# Altium project TTDT2.PrjPcb
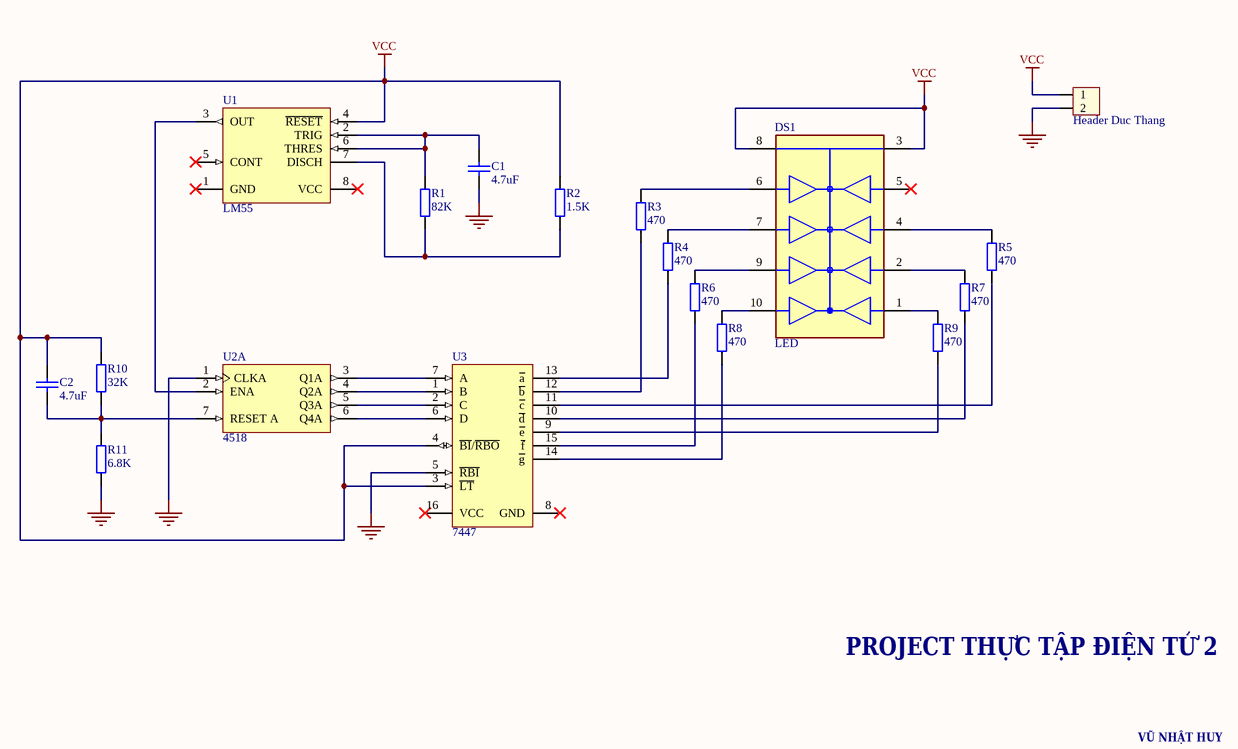
[diagram p0: Sheet1.SchDoc]
1 sheet, 18 parts. Net scope: global (net labels, ports and power ports of the same name join across sheets).
Board file: PCB1.PcbDoc

## Sheet Sheet1.SchDoc
size A4; SheetNumber: 1; SheetTotal: 1

### Parts
C1  4.7uF  [tu gom]
C2  4.7uF  [tu gom]
DS1  LED  [FP-HDSP-H153-MFG]
H1  Header Duc Thang  [VH3.96M-2]
R1  82K  [RES_0805]
R2  1.5K  [RES_0805]
R3  470  [RES_0805]
R4  470  [RES_0805]
R5  470  [RES_0805]
R6  470  [RES_0805]
R7  470  [RES_0805]
R8  470  [RES_0805]
R9  470  [RES_0805]
R10  32K  [RES_0805]
R11  6.8K  [RES_0805]
U1  LM55  [P0008A]
U2  4518  [N0016A]  (part A of 3)
U3  7447  [N0016A]

### Nets
GND: C1.2 H1.2 R11.1 U2.1(CLKA) U3.5(~{RBI})
VCC: C2.1 DS1.3(C) DS1.8(C) H1.1 R2.2 R10.2 U1.4(~{RESET}) U3.3(~{LT}) U3.4(~{BI}/~{RBO})
NetC1_1: C1.1 R1.2 U1.2(TRIG) U1.6(THRES)
NetC2_2: C2.2 R10.1 R11.2 U2.7(RESET_A)
NetDS1_1: DS1.1(ANODE_e) R9.1
NetDS1_2: DS1.2(ANODE_d) R7.1
NetDS1_4: DS1.4(ANODE_c) R5.1
NetDS1_6: DS1.6(ANODE_b) R3.2
NetDS1_7: DS1.7(ANODE_a) R4.2
NetDS1_9: DS1.9(ANODE_f) R6.2
NetDS1_10: DS1.10(ANODE_g) R8.2
NetR1_1: R1.1 R2.1 U1.7(DISCH)
NetR3_1: R3.1 U3.12(~{b})
NetR4_1: R4.1 U3.13(~{a})
NetR5_2: R5.2 U3.11(~{c})
NetR6_1: R6.1 U3.15(~{f})
NetR7_2: R7.2 U3.10(~{d})
NetR8_1: R8.1 U3.14(~{g})
NetR9_2: R9.2 U3.9(~{e})
NetU1_3: U1.3(OUT) U2.2(ENA)
NetU2_3: U2.3(Q1A) U3.7(A)
NetU2_4: U2.4(Q2A) U3.1(B)
NetU2_5: U2.5(Q3A) U3.2(C)
NetU2_6: U2.6(Q4A) U3.6(D)

Not connected (* = marked no-connect by the designer): DS1 5(ANODE_DP)*; U1 1(GND)* 5(CONT)* 8(VCC)*; U3 8(GND)* 16(VCC)*

### Notes on the sheet
- PROJECT THỰC TẬP ĐIỆN TỬ 2
- VŨ NHẬT HUY

### Library data of the parts
C1 C2 = Tu gom 472 50V: Cắm; Don_Vi: Con; So_Chan: 2; Ten_Linh_Kien: Tụ gốm 472-4.7nF 50V; Ma_Hang: MH004777; Chung_Loai: Cắm; Kieu_Chan: *
DS1 = CMP-18395-000002-1: LED 7-SEG 14.2MM CC RED RHD RHD; Manufacturer Part Number: HDSP-H153; Manufacturer: Broadcom; Wavelength: 637nm; Power Dissipation: 96mW; Standoff Height: 1.14mm; Luminous Intensity: 16mcd; Test Current: 100mA; Element Config: Common Cathode; Reverse Voltage: 15V; Viewing Angle: 100°; Forward Voltage: 2V; Device Class L2: Displays; Temperature Range High: +100°C; ComponentLink2Description: Datasheet; Device Class L3: LED Displays; Automotive: No; Digikey Description: LED 7-SEG 14.2MM CC RED RHD RHD; Display Type: LED; Lead Free: Yes; Category: Disp; Package: HDSP-H153; Height: 8mm; Octopart: https://octopart.com/hdsp-h153-broadcom-71129578; RoHS: TRUE; Device Class L1: Optoelectronics; Temperature: -20°C to +100°C; ComponentLink2URL: https://docs.broadcom.com/docs/AV02-1107EN; Forward Current: 100mA; Temperature Range Low: -20°C
H1 = Header 2P VH3.96 Duc Thang: Cắm; Ten_Linh_Kien: Header 2P XH2.54-2P Đực Thẳng; Don_Vi: Con; Ma_Hang: MH001283; Chung_Loai: Cắm
R1-R11 = RES_0805: Resistor SMD 0805; Manufacturer: *; Manufacturer Part Number: *; Distributor Link: *; LCSC: *
U1 = CMP-2000-04954-1: Precision Timer, 4.5 to 16 V, 0 to 70 degC, 8-Pin DIP, Pb-Free, Tube; Manufacturer: TexasInstruments; Maximum High Level Output Current: -200mA; Number of Internal Timers: 1; Operating Supply Voltage: 5; Maximum Low Level Output Current: 200mA; Rad Hard: No; Packaging: Rail/Tube; Manufacturer URL: http://www.ti.com/; Package Reference: P8; Package Description: 8-Pin Double In-line Package, Body 9.59 x 6.35 mm, Pitch 2.54 mm; Package URL: http://www.ti.com/lit/ml/mpdi001b/mpdi001b.pdf; Type: Standard; Datasheet URL: http://www.ti.com/general/docs/lit/getliterature.tsp?genericPartNumber=NE555&fileType=pdf; Category: Timer; Package: 8PDIP; Datasheet Version: Rev. I, 09/2014
U2 = CMP-1623-00558-2: CMOS Dual BCD Up-Counter, N0016A, TUBE; Manufacturer: Texas Instruments; Generic Part Number: CD4518B; Bits(#): 4; Schmitt Trigger: No; Inputs: 1; ICC @ Nom Voltage(Max)(mA): 0.03; Voltage(Nom)(V): 5,10,15; VCC(Min)(V): 3; VCC(Max)(V): 18; Technology Family: CD4000; F @ Nom Voltage(Max)(Mhz): 8; Output Drive (IOL/IOH)(Max)(mA): 1.5/-1.5; tpd @ Nom Voltage(Max)(ns): 230; Rating: Catalog; Output Type: CMOS; DatasheetVersion: SCHS076D; Type: Other; Function: Counter; Code_JEDEC: MS-001; Operating Temperature Range(C): -55 to 125; Input Type: CMOS; PackageReference: N0016A
U3 = CMP-0388-00321-2: BCD-to-7-Segment Decoder / Driver, 4.75 to 5.25 V, 0 to 70 degC, 16-pin DIP (N16), Pb-Free (RoHS); Manufacturer: Texas Instruments; PartNumber: SN7447AN; SubFamily: Discrete Segment LED Driver; Vin(Max)(V): 5.25; Vin(Min)(V): 4.75; ComponentLink2Description: Datasheet; ComponentLink1URL: http://www.ti.com/; Mounting Technology: Through Hole; PackageReference: N0016A; ComponentLink1Description: Manufacturer URL; PackageVersion: 4040049/E; ComponentLink3URL: http://www.ti.com/litv/pdf/mpdi002c; DatasheetVersion: SDLS111; ComponentLink2URL: http://www.ti.com/general/docs/lit/getliterature.tsp?genericPartNumber=SN7447A&fileType=pdf; Code_JEDEC: MS-001; ComponentLink3Description: Package Specification; Eco-Plan: Pb-Free (RoHS); PackageDescription: 16-Pin Plastic In-Line, Body 19.305 x 6.35 mm, Pitch 2.54 mm